# EAGLE design Power Amplifier BTL 90 Watt TDA2004 (EAGLE 9.6.2)
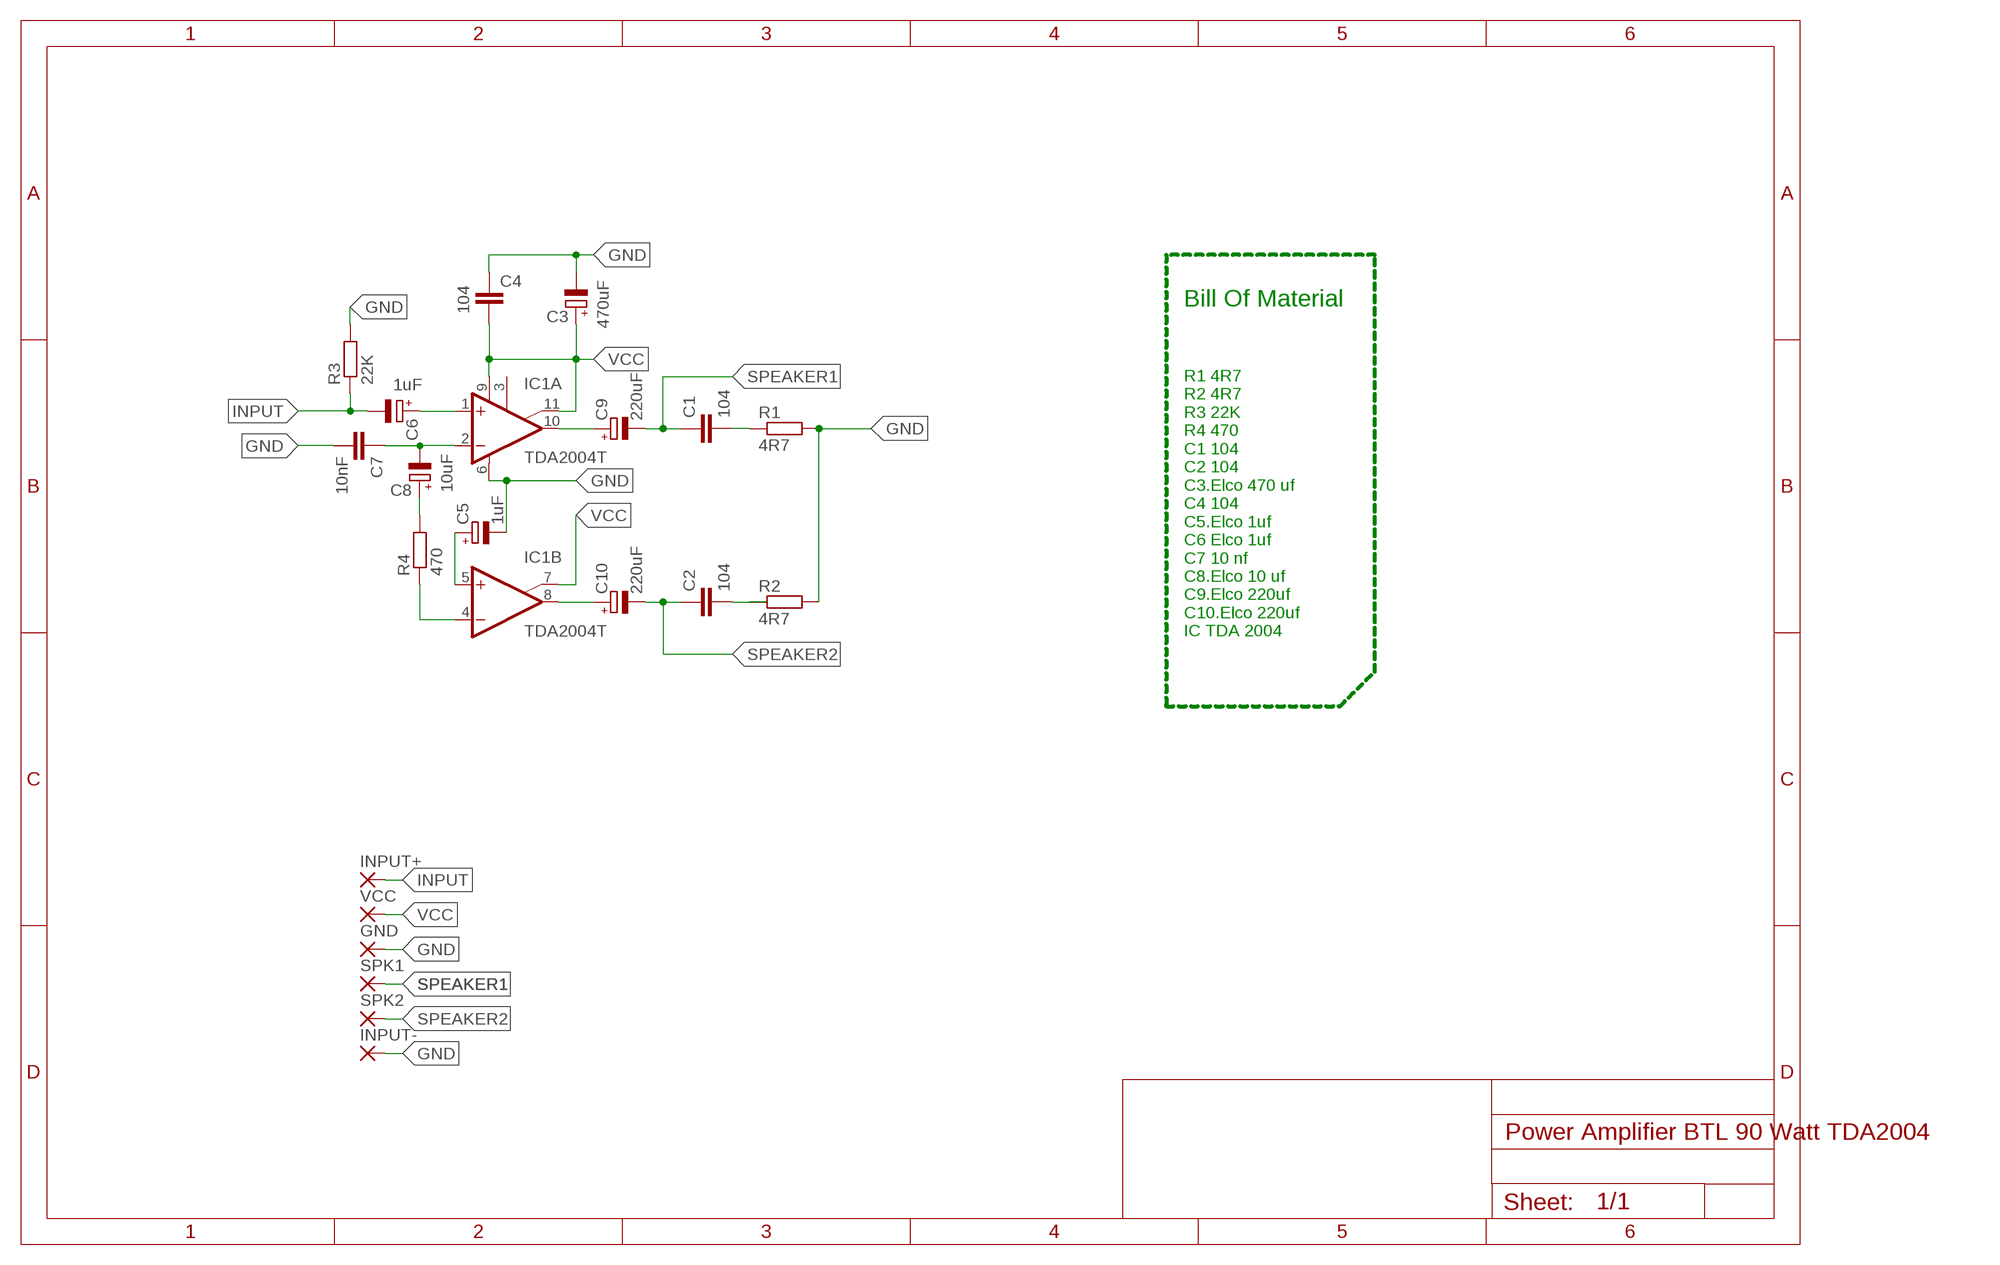
[diagram p0: schematic, sheet 1]

## Parts
C1  104  C-EU025-025X050  [C025-025X050]
C2  104  C-EU025-025X050  [C025-025X050]
C3  470uF  CPOL-EUE1.8-4  [E1,8-4]
C4  104  C-EU025-025X050  [C025-025X050]
C5  1uF  CPOL-EUE1.8-4  [E1,8-4]
C6  1uF  CPOL-EUE1.8-4  [E1,8-4]
C7  10nF  C-EU025-025X050  [C025-025X050]
C8  10uF  CPOL-EUE1.8-4  [E1,8-4]
C9  220uF  CPOL-EUE1.8-4  [E1,8-4]
C10  220uF  CPOL-EUE1.8-4  [E1,8-4]
GND  1,6/0,8  [1,6/0,8]
IC1  TDA2004T  [SIP11]
INPUT+  1,6/0,8  [1,6/0,8]
INPUT-  1,6/0,8  [1,6/0,8]
R1  4R7  R-EU_0204/7  [0204/7]
R2  4R7  R-EU_0204/7  [0204/7]
R3  22K  R-EU_0204/7  [0204/7]
R4  470  R-EU_0204/7  [0204/7]
SPK1  1,6/0,8  [1,6/0,8]
SPK2  1,6/0,8  [1,6/0,8]
VCC  1,6/0,8  [1,6/0,8]

## Nets
GND: C3.- C4.1 C5.- C7.2 GND.1(P) IC1.6(A:GND) INPUT-.1(P) R1.2 R2.2 R3.2
INPUT: C6.- INPUT+.1(P) R3.1
N$1: C9.+ IC1.10(A:OUT)
N$3: C1.2 R1.1
N$4: C10.+ IC1.8(B:OUT)
N$6: C2.2 R2.1
N$7: C6.+ IC1.1(A:+IN)
N$8: C7.1 C8.- IC1.2(A:-IN)
N$9: C8.+ R4.2
N$10: IC1.4(B:-IN) R4.1
N$12: C5.+ IC1.5(B:+IN)
SPEAKER1: C1.1 C9.- SPK1.1(P)
SPEAKER2: C2.1 C10.- SPK2.1(P)
VCC: C3.+ C4.2 IC1.7(B:BTSP) IC1.9(A:V+) IC1.11(A:BTSP) VCC.1(P)
Unconnected: IC1.3(A:SVRR)

## Notes on the sheet
- Bill Of Material
- R1 4R7
  R2 4R7
  R3 22K
  R4 470
  C1 104
  C2 104
  C3.Elco 470 uf
  C4 104
  C5.Elco 1uf
  C6 Elco 1uf
  C7 10 nf
  C8.Elco 10 uf 
  C9.Elco 220uf
  C10.Elco 220uf
  IC TDA 2004

## Library data of the parts
C1 C2 C4 C7 = rcl:C-EU: CAPACITOR, European symbol; SPICEPREFIX: C
C3 C5 C6 C8-C10 = rcl:CPOL-EU: POLARIZED CAPACITOR, European symbol; SPICEPREFIX: C
GND INPUT+ INPUT- SPK1 SPK2 VCC = wirepad:1,6/0,8: THROUGH-HOLE PAD
IC1 = TDA2004:TDA2004: Power OP AMP Check availability <https://pricing.snapeda.com/parts/TDA2004/STMicroelectronics/view-part?ref=eda>; AVAILABILITY: In Stock; DESCRIPTION: Amplifier IC 2-Channel (Stereo) Class B 11-Multiwatt; MF: STMicroelectronics; MP: TDA2004; PACKAGE: Multiwatt-11 STMicroelectronics; PRICE: None; PURCHASE-URL: https://pricing.snapeda.com/search/part/TDA2004/?ref=eda
R1-R4 = rcl:R-EU_: RESISTOR, European symbol; SPICEPREFIX: R

## Board
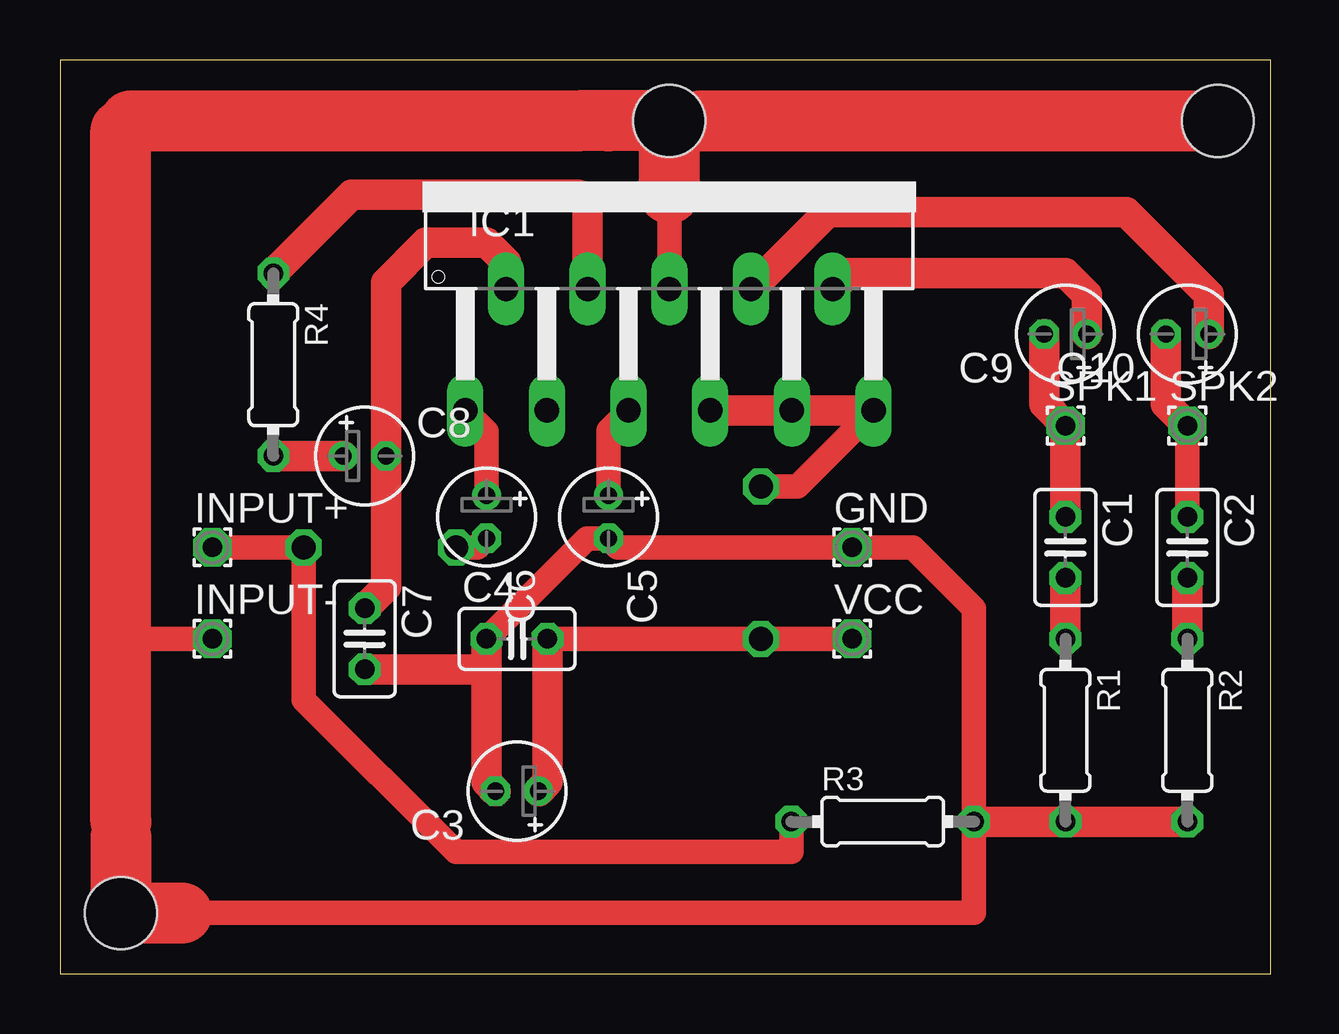
[diagram p1: board, top side]
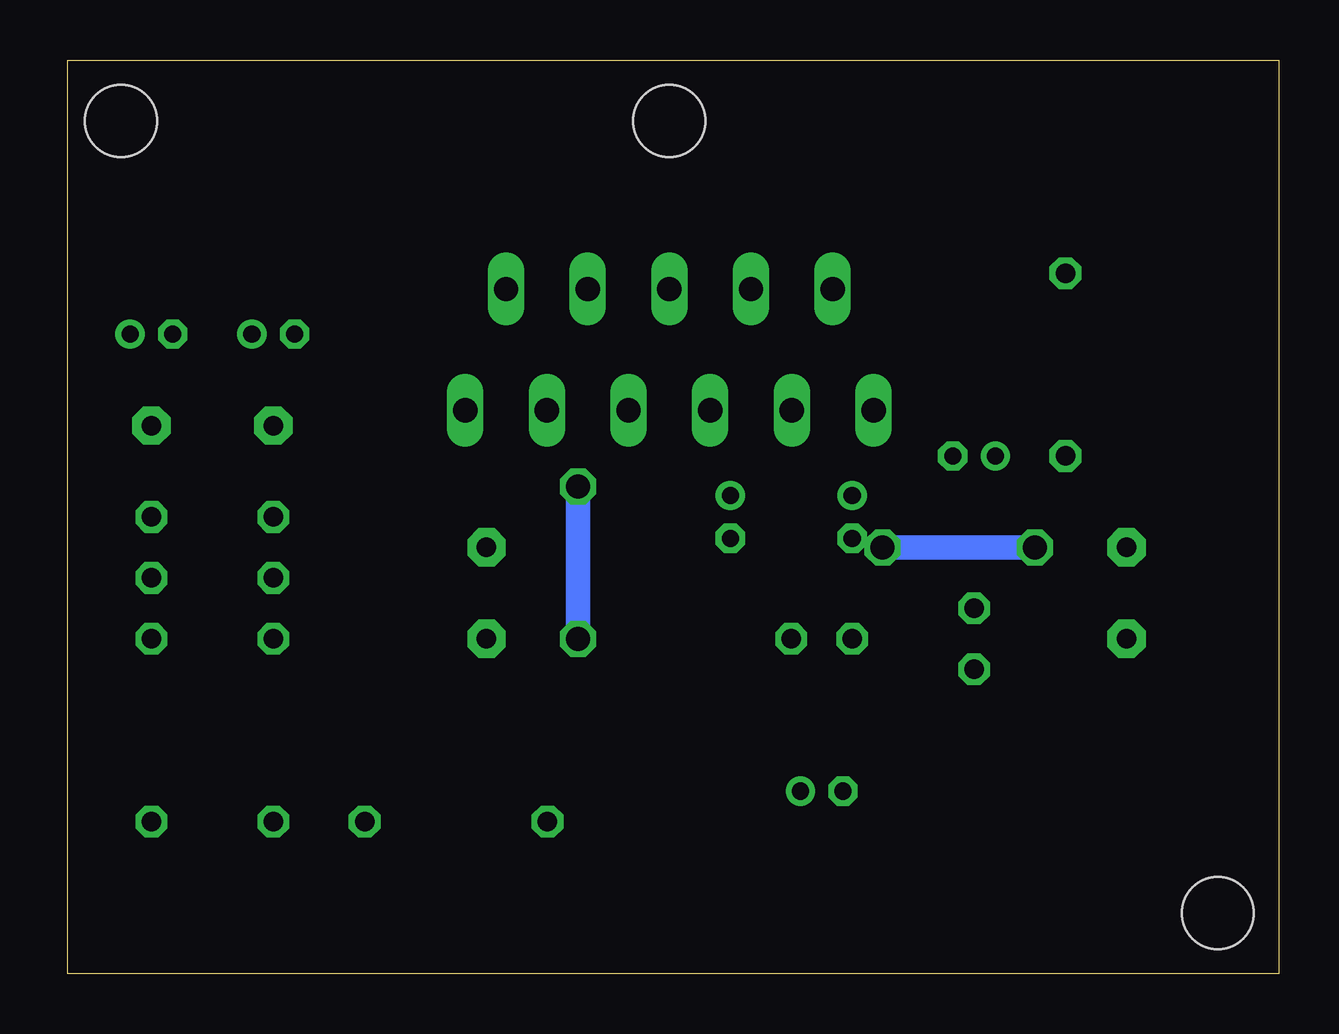
[diagram p2: board, bottom side, seen from below]

Size 50.47 x 38.09 mm. Coordinates in mm from the lower left corner, seen from the top.
Outline: 0,0 50.47,0 50.47,38.09 0,38.09 0,0
Copper layers (1*16): Top 0.035mm / dielectric 1.5mm / Bottom 0.035mm
Design rules "default": minimum track width 6mil, minimum drill 0.35mm, track to track 6mil, track to pad 6mil, pad to pad 6mil, via to via 6mil, smd to smd 6mil, copper to edge 40mil, drill to drill 6mil, minimum pad ring 10mil, minimum via ring 8mil, stop-mask expansion 4mil, vias tented up to drill 0mil, thermal gap 10mil
Holes 3 mm at 25.4,35.56 2.54,2.54 48.26,35.56

### Footprints (pad centres in the part's own frame; a part is rotated, then mirrored left to right if it is on the bottom)
C025-025X050 = drill 0.813 octagon: 1 -1.27,0; 2 1.27,0
E1,8-4 = drill 0.711 pad 1.168: + -0.889,0 | drill 0.711 pad 1.168 octagon: - 0.889,0
1,6/0,8 = drill 0.813 pad 1.6 octagon: 1 0,0
SIP11 = drill 1.016 long: 1 -8.509,-9.525; 2 -6.807,-4.47; 3 -5.105,-9.525; 4 -3.404,-4.47; 5 -1.702,-9.525; 6 0,-4.47; 7 1.702,-9.525; 8 3.404,-4.47; 9 5.105,-9.525; 10 6.807,-4.47; 11 8.509,-9.525
0204/7 = drill 0.813 octagon: 1 -3.81,0; 2 3.81,0

### Placement (x,y rotation side)
C1  41.91,17.78 270 top
C2  46.99,17.78 270 top
C3  19.05,7.62 180 top
C4  19.05,13.97 0 top
C5  22.86,19.05 270 top
C6  17.78,19.05 270 top
C7  12.7,13.97 270 top
C8  12.7,21.59 0 top
C9  41.91,26.67 180 top
C10  46.99,26.67 180 top
GND  33.02,17.78 0 top
IC1  25.4,33.02 0 top
INPUT+  6.35,17.78 0 top
INPUT-  6.35,13.97 0 top
R1  41.91,10.16 270 top
R2  46.99,10.16 270 top
R3  34.29,6.35 0 top
R4  8.89,25.4 270 top
SPK1  41.91,22.86 0 top
SPK2  46.99,22.86 0 top
VCC  33.02,13.97 0 top

### Tracks (layer width: path | path; a pad name or v marks a point on that pad's centre or on a via)
GND
  Top 1.016: C4.1 21.97,18.16 C5.- 23.24,17.78 GND.1 35.56,17.78 38.1,15.24 R3.2 38.1,2.54 5.08,2.54 | INPUT-.1 2.54,13.97 | IC1.6 25.4,32.54 | 25.4,35.56 26.67,35.56
  Top 1.27: R2.2 R1.2 R3.2 | C7.2 17.78,12.7 C4.1 17.78,8 C3.- | 2.93,35.56 2.54,35.17 2.54,13.97 2.54,6.35 2.54,5.69
  Top 2.54: 25.4,32.54 25.4,35.56 22.86,35.56 21.61,35.56 2.93,35.56 | 2.54,5.69 2.54,2.54 5.08,2.54 | 2.54,6.35 2.54,35.17 | 26.67,35.56 48.26,35.56
INPUT  (via drill 1)
  Top 1.016: C6.- 17.4,17.78 v16.51,17.78 | INPUT+.1 v10.16,17.78 10.16,11.43 16.51,5.08 30.48,5.08 R3.1
  Bottom 1.016: v16.51,17.78 v10.16,17.78
N$1
  Top 1.27: IC1.10 32.87,29.21 41.91,29.21 42.8,28.32 C9.+
N$3
  Top 1.27: C1.2 R1.1
N$4
  Top 1.27: IC1.8 32,31.75 44.45,31.75 47.88,28.32 C10.+
N$6
  Top 1.27: C2.2 R2.1
N$7
  Top 1.016: IC1.1 17.78,22.61 C6.+
N$8
  Top 1.27: IC1.2 18.59,29.67 17.78,30.48 15.24,30.48 13.59,28.83 C8.- 13.59,16.13 C7.1
N$9
  Top 1.27: R4.2 C8.+
N$10
  Top 1.27: R4.1 12.16,32.48 21.59,32.48 22,32.07 IC1.4
N$12
  Top 1.016: IC1.5 22.86,22.66 C5.+
SPEAKER1
  Top 1.27: C9.- 41.02,23.75 SPK1.1 C1.1
SPEAKER2
  Top 1.016: C2.1 SPK2.1
  Top 1.27: C10.- 46.1,23.75 SPK2.1
VCC  (via drill 1)
  Top 1.016: C4.2 VCC.1 v29.21,13.97 | IC1.11 30.73,20.32 v29.21,20.32
  Top 1.27: C3.+ 20.32,8 C4.2 | IC1.7 IC1.9 IC1.11
  Bottom 1.016: v29.21,20.32 v29.21,13.97